# Altium schematic sheet Discharge.SchDoc
size A4; SheetNumber: 5; SheetTotal: 11
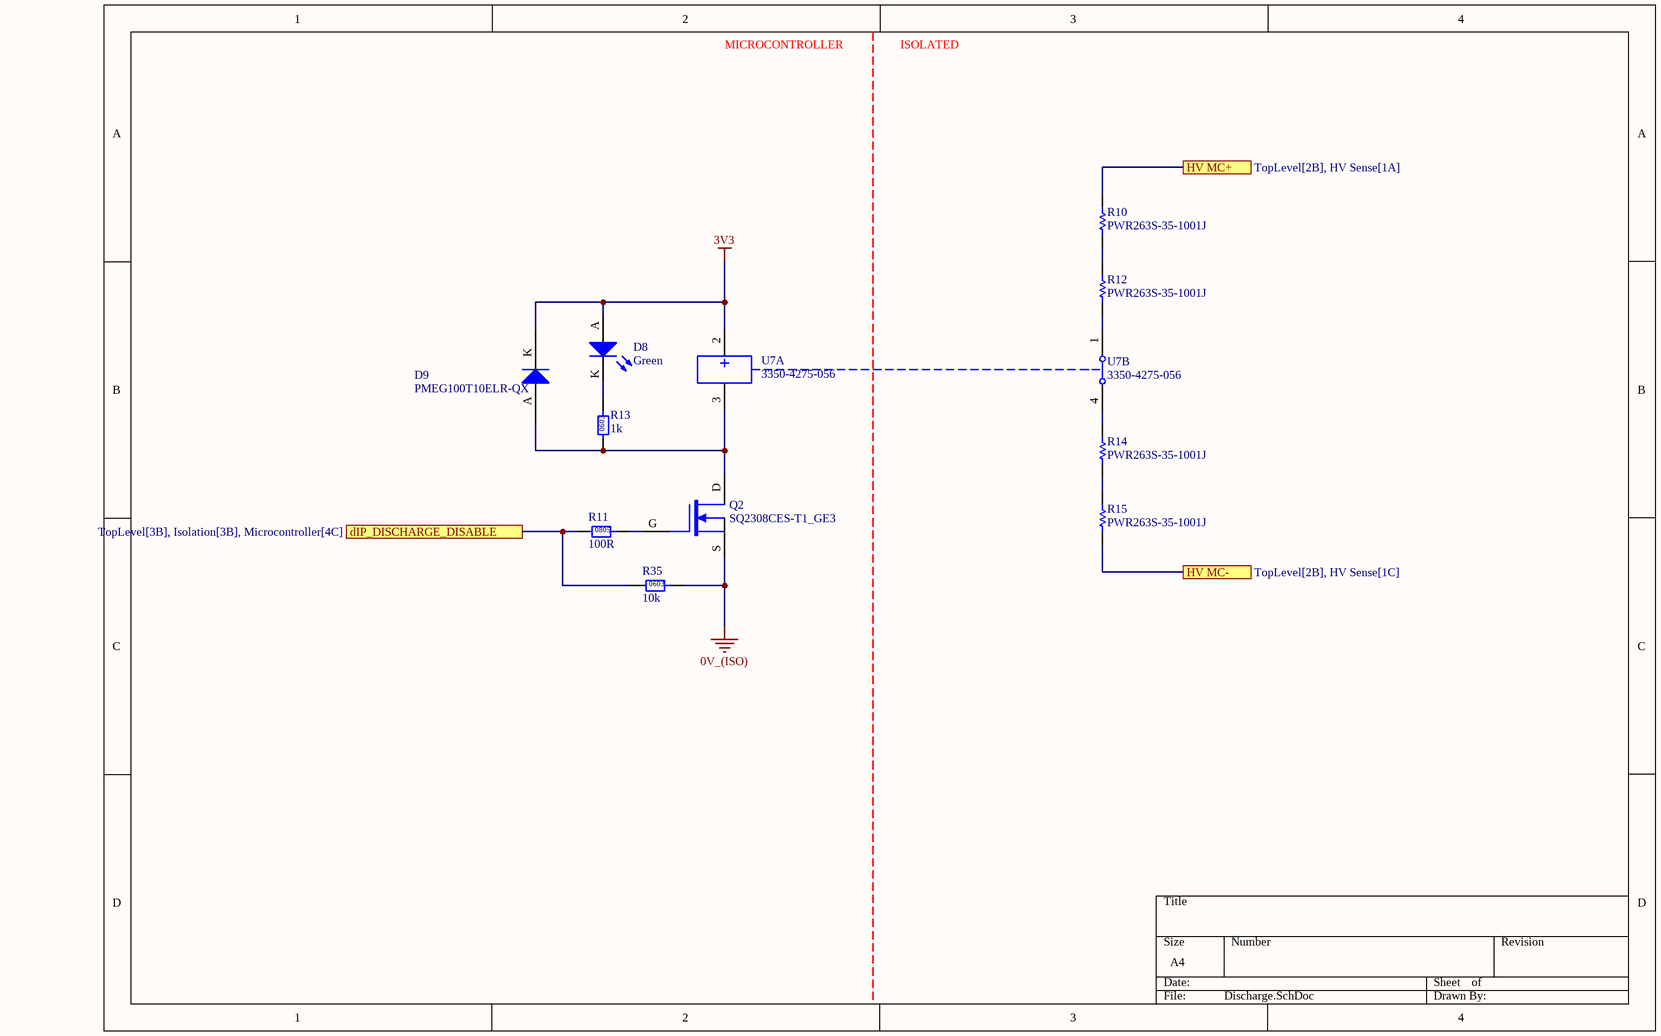
[diagram p0: Discharge.SchDoc]

## Parts
D8  Green  [0805 LED]
D9  PMEG100T10ELR-QX  [SODFL350X110-2N]
Q2  SQ2308CES-T1_GE3  [VSHY SOT-23-3]
R10  PWR263S-35-1001J  [B TO-263]
R11  100R  [0805]
R12  PWR263S-35-1001J  [B TO-263]
R13  1k  [0603]
R14  PWR263S-35-1001J  [B TO-263]
R15  PWR263S-35-1001J  [B TO-263]
R35  10k  [0603]
U7  3350-4275-056  [CI SPST]  (parts A,B of 2)

## Ports
dIP_DISCHARGE_DISABLE (see TopLevel[3B], Isolation[3B], Microcontroller[4C]), HV MC+ (see TopLevel[2B], HV Sense[1A]), HV MC- (see TopLevel[2B], HV Sense[1C])

## Nets
0V_(ISO): Q2.S R35.2
3V3: D8.A D9.K U7.2
dIP_DISCHARGE_DISABLE: R11.1 R35.1 ; port dIP_DISCHARGE_DISABLE
HV MC+: R10.1 ; port HV MC+
HV MC-: R15.2 ; port HV MC-
NetD8_K: D8.K R13.2
NetD9_A: D9.A Q2.D R13.1 U7.3
NetQ2_G: Q2.G R11.2
NetR10_2: R10.2 R12.1
NetR12_2: R12.2 U7.1
NetR14_1: R14.1 U7.4
NetR14_2: R14.2 R15.1

## Notes on the sheet
- MICROCONTROLLER
- ISOLATED
- (in symbol RC0603FR-071KL) 0603
- (in symbol RC0603FR-0710KL) 0603
- (in symbol RC0805FR07100RL) 0805

## Library data of the parts
D8 = SML-210FTT86: Green LED Indication - Discrete 1.75V 0805 (2012 Metric); Manufacturer: ROHM Semiconductor; Part Number: SML-210FTT86; Colour: Green; Digikey Part Number: 511-1285-1-ND
D9 = CMP-004-00005-4: Diode 100 V 1A Surface Mount SOD-123W
Q2 = SQ2308CES-T1_GE3: MOSFET N-CH 60V 2.3A SOT23; Manufacturer: Vishay Siliconix; Type: N-channel; Rated Power: 2W; Published: 24-Mar-1999; LatestRevisionDate: 29-May-2009; LatestRevisionNote: IPC-7351 Footprint Added.; PackageVersion: Sep-2000; PackageReference: SOT-343; Publisher: Altium Limited; PackageDescription: 4-Pin SOT-343 Package 1.3 mm Pitch, 2.1 mm Lead Span; Part Number: SQ2308CES-T1_GE3; Digikey Part Number: SQ2308CES-T1_GE3CT-ND
R10 R12 R14 R15 = CMP-037-000402-1: Manufacturer: Bournes Inc; Value: 1k; Rated Voltage: 35W; Tolerance: 0.05; Part Number: PWR263S-35-1001J; Digikey Part Number: PWR263S-35-1001J-ND
R11 = RC0805FR07100RL: Manufacturer: YAGEO; Tolerance: 0.01; Rated Power: 0.125W; Part Number: RC0805FR07100RL; Value: 100R; Material: FR-07; Digikey Part Number: 311-100CRCT-ND
R13 = RC0603FR-071KL: Manufacturer: YAGEO; Tolerance: 0.01; Rated Power: 0.1W; Part Number: RC0603FR-071KL; Value: 1k; Digikey Part Number: 311-1.00KHRCT-ND; Material: FR-07
R35 = RC0603FR-0710KL: Manufacturer: YAGEO; Tolerance: 0.01; Rated Power: 0.1W; Part Number: RC0603FR-0710KL; Value: 10k; Material: FR-07; Digikey Part Number: 311-10.0KHRCT-ND
U7 = CMP-035-000005-1: RELAY REED HV SPST 200W 3A 5V (NC); Part Number: 3350-4275-056